# Altium schematic sheet SoM-Connectors.SchDoc
size A3; DocumentNumber: 2; SheetNumber: 2; SheetTotal: 9; PageSetup: Record=PageOptions|CenterHorizontal=True|CenterVertical=True|PrintScale=0.97|XCorrection=1.00|YCorrection=1.00|PrintKind=1|BorderSize=5000000|LeftOffset=0|BottomOffset=0|Orientation=2|PaperLength=2970|PaperWidth=2100|Scale=100|PaperSource=7|PrintQuality=600|MediaType=1|DitherType=10|PaperKind=A4|PrintScaleMode=1
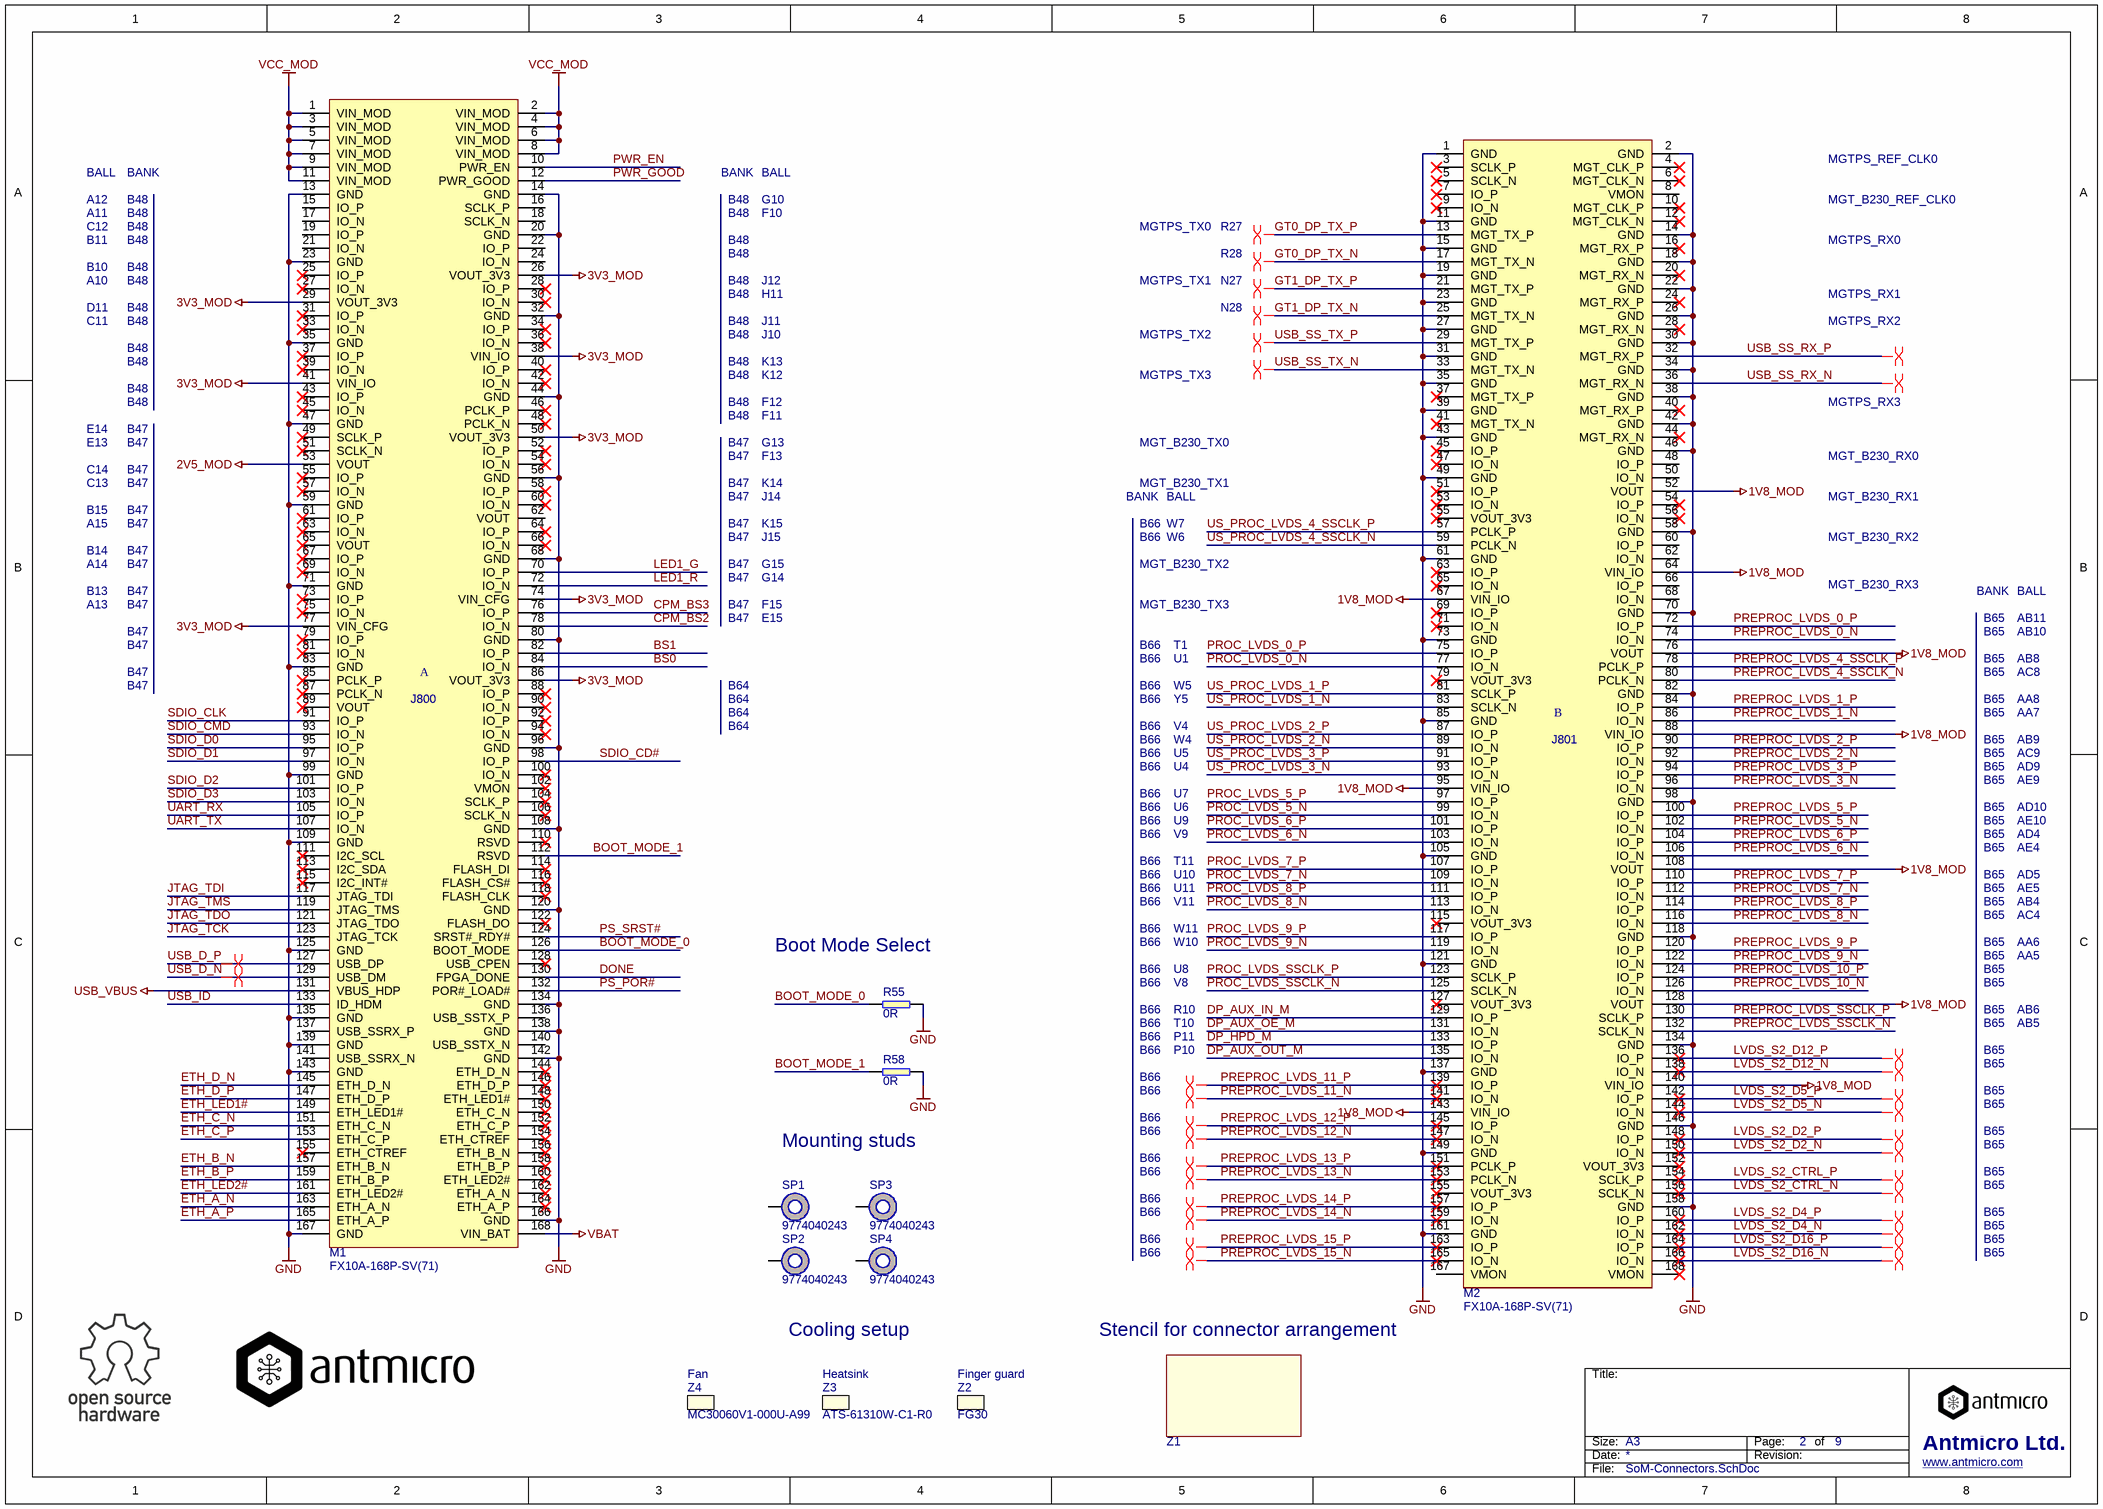
[diagram p0: SoM-Connectors.SchDoc]

## Parts
M1  FX10A-168P-SV(71)  [HIROSE_FX10A-168P-SV(71)]
M2  FX10A-168P-SV(71)  [HIROSE_FX10A-168P-SV(71)]
R55  0R  [0603]
R58  0R  [0603]
SP1  9774040243  [M2-4mm]
SP2  9774040243  [M2-4mm]
SP3  9774040243  [M2-4mm]
SP4  9774040243  [M2-4mm]
Z1  Mechanical  [mercury_74x54_module]  (value not drawn)  (no BOM)
Z2  FG30  (no BOM)
Z3  ATS-61310W-C1-R0  (no BOM)
Z4  MC30060V1-000U-A99  (no BOM)

## Nets
1V8_MOD: M2.52(VOUT) M2.64(VIN_IO) M2.67(VIN_IO) M2.76(VOUT) M2.88(VIN_IO) M2.95(VIN_IO) M2.108(VOUT) M2.128(VOUT) M2.140(VIN_IO) M2.143(VIN_IO)
2V5_MOD: M1.53(VOUT)
3V3_MOD: M1.26(VOUT_3V3) M1.29(VOUT_3V3) M1.38(VIN_IO) M1.41(VIN_IO) M1.50(VOUT_3V3) M1.74(VIN_CFG) M1.77(VIN_CFG) M1.86(VOUT_3V3)
GND: M1.13(GND) M1.14(GND) M1.20(GND) M1.23(GND) M1.32(GND) M1.35(GND) M1.44(GND) M1.47(GND) M1.56(GND) M1.59(GND) M1.68(GND) M1.71(GND) M1.80(GND) M1.83(GND) M1.96(GND) M1.99(GND) M1.108(GND) M1.109(GND) M1.120(GND) M1.125(GND) M1.134(GND) M1.135(GND) M1.138(GND) M1.139(GND) M1.142(GND) M1.143(GND) M1.166(GND) M1.167(GND) M2.1(GND) M2.2(GND) M2.11(GND) M2.14(GND) M2.15(GND) M2.18(GND) M2.19(GND) M2.22(GND) M2.23(GND) M2.26(GND) M2.27(GND) M2.30(GND) M2.31(GND) M2.34(GND) M2.35(GND) M2.38(GND) M2.39(GND) M2.42(GND) M2.43(GND) M2.46(GND) M2.49(GND) M2.58(GND) M2.61(GND) M2.70(GND) M2.73(GND) M2.82(GND) M2.85(GND) M2.98(GND) M2.105(GND) M2.118(GND) M2.121(GND) M2.134(GND) M2.137(GND) M2.146(GND) M2.149(GND) M2.158(GND) M2.161(GND) R55.2 R58.2
USB_VBUS: M1.131(VBUS_HDP)
VBAT: M1.168(VIN_BAT)
VCC_MOD: M1.1(VIN_MOD) M1.2(VIN_MOD) M1.3(VIN_MOD) M1.4(VIN_MOD) M1.5(VIN_MOD) M1.6(VIN_MOD) M1.7(VIN_MOD) M1.8(VIN_MOD) M1.9(VIN_MOD) M1.11(VIN_MOD)
BOOT_MODE_0: M1.126(BOOT_MODE) R55.1
BOOT_MODE_1: M1.112(RSVD) R58.1
BS0: M1.84(IO_N)
BS1: M1.82(IO_P)
CPM_BS2: M1.78(IO_N)
CPM_BS3: M1.76(IO_P)
DONE: M1.130(FPGA_DONE)
DP_AUX_IN_M: M2.129(IO_P)
DP_AUX_OE_M: M2.131(IO_N)
DP_AUX_OUT_M: M2.135(IO_N)
DP_HPD_M: M2.133(IO_P)
ETH_A_N: M1.163(ETH_A_N)
ETH_A_P: M1.165(ETH_A_P)
ETH_B_N: M1.157(ETH_B_N)
ETH_B_P: M1.159(ETH_B_P)
ETH_C_N: M1.151(ETH_C_N)
ETH_C_P: M1.153(ETH_C_P)
ETH_D_N: M1.145(ETH_D_N)
ETH_D_P: M1.147(ETH_D_P)
ETH_LED1#: M1.149(ETH_LED1#)
ETH_LED2#: M1.161(ETH_LED2#)
GT0_DP_TX_N: M2.17(MGT_TX_N)
GT0_DP_TX_P: M2.13(MGT_TX_P)
GT1_DP_TX_N: M2.25(MGT_TX_N)
GT1_DP_TX_P: M2.21(MGT_TX_P)
JTAG_TCK: M1.123(JTAG_TCK)
JTAG_TDI: M1.117(JTAG_TDI)
JTAG_TDO: M1.121(JTAG_TDO)
JTAG_TMS: M1.119(JTAG_TMS)
LED1_G: M1.70(IO_P)
LED1_R: M1.72(IO_N)
LVDS_S2_CTRL_N: M2.156(SCLK_N)
LVDS_S2_CTRL_P: M2.154(SCLK_P)
LVDS_S2_D2_N: M2.150(IO_N)
LVDS_S2_D2_P: M2.148(IO_P)
LVDS_S2_D4_N: M2.162(IO_N)
LVDS_S2_D4_P: M2.160(IO_P)
LVDS_S2_D5_N: M2.144(IO_N)
LVDS_S2_D5_P: M2.142(IO_P)
LVDS_S2_D12_N: M2.138(IO_N)
LVDS_S2_D12_P: M2.136(IO_P)
LVDS_S2_D16_N: M2.166(IO_N)
LVDS_S2_D16_P: M2.164(IO_P)
PREPROC_LVDS_0_N: M2.74(IO_N)
PREPROC_LVDS_0_P: M2.72(IO_P)
PREPROC_LVDS_1_N: M2.86(IO_N)
PREPROC_LVDS_1_P: M2.84(IO_P)
PREPROC_LVDS_2_N: M2.92(IO_N)
PREPROC_LVDS_2_P: M2.90(IO_P)
PREPROC_LVDS_3_N: M2.96(IO_N)
PREPROC_LVDS_3_P: M2.94(IO_P)
PREPROC_LVDS_4_SSCLK_N: M2.80(PCLK_N)
PREPROC_LVDS_4_SSCLK_P: M2.78(PCLK_P)
PREPROC_LVDS_5_N: M2.102(IO_N)
PREPROC_LVDS_5_P: M2.100(IO_P)
PREPROC_LVDS_6_N: M2.106(IO_N)
PREPROC_LVDS_6_P: M2.104(IO_P)
PREPROC_LVDS_7_N: M2.112(IO_N)
PREPROC_LVDS_7_P: M2.110(IO_P)
PREPROC_LVDS_8_N: M2.116(IO_N)
PREPROC_LVDS_8_P: M2.114(IO_P)
PREPROC_LVDS_9_N: M2.122(IO_N)
PREPROC_LVDS_9_P: M2.120(IO_P)
PREPROC_LVDS_10_N: M2.126(IO_N)
PREPROC_LVDS_10_P: M2.124(IO_P)
PREPROC_LVDS_11_N: M2.141(IO_N)
PREPROC_LVDS_11_P: M2.139(IO_P)
PREPROC_LVDS_12_N: M2.147(IO_N)
PREPROC_LVDS_12_P: M2.145(IO_P)
PREPROC_LVDS_13_N: M2.153(PCLK_N)
PREPROC_LVDS_13_P: M2.151(PCLK_P)
PREPROC_LVDS_14_N: M2.159(IO_N)
PREPROC_LVDS_14_P: M2.157(IO_P)
PREPROC_LVDS_15_N: M2.165(IO_N)
PREPROC_LVDS_15_P: M2.163(IO_P)
PREPROC_LVDS_SSCLK_N: M2.132(SCLK_N)
PREPROC_LVDS_SSCLK_P: M2.130(SCLK_P)
PROC_LVDS_0_N: M2.77(IO_N)
PROC_LVDS_0_P: M2.75(IO_P)
PROC_LVDS_5_N: M2.99(IO_N)
PROC_LVDS_5_P: M2.97(IO_P)
PROC_LVDS_6_N: M2.103(IO_N)
PROC_LVDS_6_P: M2.101(IO_P)
PROC_LVDS_7_N: M2.109(IO_N)
PROC_LVDS_7_P: M2.107(IO_P)
PROC_LVDS_8_N: M2.113(IO_N)
PROC_LVDS_8_P: M2.111(IO_P)
PROC_LVDS_9_N: M2.119(IO_N)
PROC_LVDS_9_P: M2.117(IO_P)
PROC_LVDS_SSCLK_N: M2.125(SCLK_N)
PROC_LVDS_SSCLK_P: M2.123(SCLK_P)
PS_POR#: M1.132(POR#_LOAD#)
PS_SRST#: M1.124(SRST#_RDY#)
PWR_EN: M1.10(PWR_EN)
PWR_GOOD: M1.12(PWR_GOOD)
SDIO_CD#: M1.98(IO_P)
SDIO_CLK: M1.91(IO_P)
SDIO_CMD: M1.93(IO_N)
SDIO_D0: M1.95(IO_P)
SDIO_D1: M1.97(IO_N)
SDIO_D2: M1.101(IO_P)
SDIO_D3: M1.103(IO_N)
UART_RX: M1.105(IO_P)
UART_TX: M1.107(IO_N)
US_PROC_LVDS_1_N: M2.83(SCLK_N)
US_PROC_LVDS_1_P: M2.81(SCLK_P)
US_PROC_LVDS_2_N: M2.89(IO_N)
US_PROC_LVDS_2_P: M2.87(IO_P)
US_PROC_LVDS_3_N: M2.93(IO_N)
US_PROC_LVDS_3_P: M2.91(IO_P)
US_PROC_LVDS_4_SSCLK_N: M2.59(PCLK_N)
US_PROC_LVDS_4_SSCLK_P: M2.57(PCLK_P)
USB_D_N: M1.129(USB_DM)
USB_D_P: M1.127(USB_DP)
USB_ID: M1.133(ID_HDM)
USB_SS_RX_N: M2.36(MGT_RX_N)
USB_SS_RX_P: M2.32(MGT_RX_P)
USB_SS_TX_N: M2.33(MGT_TX_N)
USB_SS_TX_P: M2.29(MGT_TX_P)

Not connected (* = marked no-connect by the designer): M1 15(IO_P) 16(SCLK_P) 17(IO_N) 18(SCLK_N) 19(IO_P) 21(IO_N) 22(IO_P) 24(IO_N) 25(IO_P)* 27(IO_N)* 28(IO_P)* 30(IO_N)* 31(IO_P)* 33(IO_N)* 34(IO_P)* 36(IO_N)* 37(IO_P)* 39(IO_N)* 40(IO_P)* 42(IO_N)* 43(IO_P)* 45(IO_N)* 46(PCLK_P)* 48(PCLK_N)* 49(SCLK_P)* 51(SCLK_N)* 52(IO_P)* 54(IO_N)* 55(IO_P)* 57(IO_N)* 58(IO_P)* 60(IO_N)* 61(IO_P)* 62(VOUT) 63(IO_N)* 64(IO_P)* 65(VOUT)* 66(IO_N)* 67(IO_P)* 69(IO_N)* 73(IO_P)* 75(IO_N)* 79(IO_P)* 81(IO_N)* 85(PCLK_P)* 87(PCLK_N)* 88(IO_P)* 89(VOUT)* 90(IO_N)* 92(IO_P)* 94(IO_N)* 100(IO_N)* 102(VMON)* 104(SCLK_P)* 106(SCLK_N)* 110(RSVD)* 111(I2C_SCL)* 113(I2C_SDA)* 114(FLASH_DI)* 115(I2C_INT#)* 116(FLASH_CS#)* 118(FLASH_CLK)* 122(FLASH_DO)* 128(USB_CPEN)* 136(USB_SSTX_P) 137(USB_SSRX_P) 140(USB_SSTX_N) 141(USB_SSRX_N) 144(ETH_D_N)* 146(ETH_D_P)* 148(ETH_LED1#)* 150(ETH_C_N)* 152(ETH_C_P)* 154(ETH_CTREF)* 155(ETH_CTREF)* 156(ETH_B_N)* 158(ETH_B_P)* 160(ETH_LED2#)* 162(ETH_A_N)* 164(ETH_A_P)*; M2 3(SCLK_P)* 4(MGT_CLK_P)* 5(SCLK_N)* 6(MGT_CLK_N)* 7(IO_P)* 8(VMON) 9(IO_N)* 10(MGT_CLK_P)* 12(MGT_CLK_N)* 16(MGT_RX_P)* 20(MGT_RX_N)* 24(MGT_RX_P)* 28(MGT_RX_N)* 37(MGT_TX_P)* 40(MGT_RX_P)* 41(MGT_TX_N)* 44(MGT_RX_N)* 45(IO_P)* 47(IO_N)* 48(IO_P) 50(IO_N) 51(IO_P)* 53(IO_N)* 54(IO_P)* 55(VOUT_3V3)* 56(IO_N)* 60(IO_P) 62(IO_N) 63(IO_P)* 65(IO_N)* 66(IO_P) 68(IO_N) 69(IO_P)* 71(IO_N)* 79(VOUT_3V3)* 115(VOUT_3V3)* 127(VOUT_3V3)* 152(VOUT_3V3)* 155(VOUT_3V3)* 167(VMON) 168(VMON)*; SP1 1; SP2 1; SP3 1; SP4 1

## Layout directives
differential pair: GT0_DP_TX_N, GT0_DP_TX_P, GT1_DP_TX_N, GT1_DP_TX_P, LVDS_S2_CTRL_N, LVDS_S2_CTRL_P, LVDS_S2_D2_N, LVDS_S2_D2_P, LVDS_S2_D4_N, LVDS_S2_D4_P, LVDS_S2_D5_N, LVDS_S2_D5_P, LVDS_S2_D12_N, LVDS_S2_D12_P, LVDS_S2_D16_N, LVDS_S2_D16_P, PREPROC_LVDS_11_N, PREPROC_LVDS_11_P, PREPROC_LVDS_12_N, PREPROC_LVDS_12_P, PREPROC_LVDS_13_N, PREPROC_LVDS_13_P, PREPROC_LVDS_14_N, PREPROC_LVDS_14_P, PREPROC_LVDS_15_N, PREPROC_LVDS_15_P, USB_D_N, USB_D_P, USB_SS_RX_N, USB_SS_RX_P, USB_SS_TX_N, USB_SS_TX_P

## Notes on the sheet
- BALL
- BANK
- MGTPS_REF_CLK0
- A12
- A11
- C12
- B11
- B48
- G10
- F10
- MGTPS_TX0
- R27
- MGT_B230_REF_CLK0
- MGTPS_RX0
- B10
- A10
- D11
- J12
- H11
- MGTPS_TX1
- R28
- N27
- N28
- MGTPS_RX1
- C11
- J11
- J10
- K13
- K12
- MGTPS_TX2
- MGTPS_TX3
- MGTPS_RX2
- E14
- E13
- B47
- F12
- F11
- G13
- MGT_B230_TX0
- MGTPS_RX3
- C14
- C13
- B15
- F13
- K14
- J14
- MGT_B230_TX1
- MGT_B230_RX0
- MGT_B230_RX1
- A15
- B14
- A14
- K15
- J15
- G15
- G14
- B66
- MGT_B230_TX2
- W7
- W6
- MGT_B230_RX2
- MGT_B230_RX3
- B13
- A13
- F15
- E15
- MGT_B230_TX3
- T1
- B65
- AB11
- AB10
- (near M1) J800
- B64
- U1
- W5
- Y5
- AB8
- AC8
- AA8
- AA7
- V4
- W4
- U5
- U4
- (near M2) J801
- AB9
- AC9
- AD9
- AE9
- U7
- U6
- U9
- V9
- AD10
- AE10
- AD4
- AE4
- T11
- U10
- U11
- V11
- AD5
- AE5
- AB4
- AC4
- (near R55) Boot Mode Select
- W11
- W10
- U8
- V8
- AA6
- AA5
- R10
- T10
- P11
- P10
- AB6
- AB5
- Mounting studs
- (near Z4) Fan
- Cooling setup
- (near Z3) Heatsink
- (near Z2) Finger guard
- Stencil for connector arrangement
- Title:
- Size:
- Date:
- A3
- Revision:
- Page:
- of
- Antmicro Ltd.
- File:
- www.antmicro.com
- (in symbol Mercury_US1_A) A
- (in symbol Mercury_US1_B) B

## Library data of the parts
M1 = Mercury_US1_A: Enclustra Mercury Ultrascale connector; Manufacturer: Hirose; Part Number: Mercury_US1_A; Value: FX10A-168P-SV(71); MPN: FX10A-168P-SV(71)
M2 = Mercury_US1_B: Enclustra Mercury Ultrascale connector; Manufacturer: Hirose; Part Number: Mercury_US1_B; Value: FX10A-168P-SV(71); MPN: FX10A-168P-SV(71)
R55 R58 = R_0R_0603: SMT Resistor 0R 0603; Manufacturer: BOURNS; MPN: CR0603-J/-000ELF; Value: 0R; Part Number: R_0R_0603
SP1-SP4 = WE_9774040243: M2x4; Manufacturer: WURTH ELEKTRONIK; MPN: 9774040243R; Part Number: WE_9774040243; Value: 9774040243
Z1 = MercuryModule_74x54: Part Number: MercuryModule_74x54
Z2 = FG30: Fan Finger Guard, Grille, 30mm 30mm 24mm, steel; Manufacturer: SEPA; Part Number: FG30; Value: FG30; MPN: FG30
Z3 = ATS-61310W-C1-R0: Heat Sinks FANSINK ASSY 30.25 X 30.25 X 24.5 (MM); Manufacturer: Advanced Thermal Solution; Part Number: ATS-61310W-C1-R0; Value: ATS-61310W-C1-R0; MPN: ATS-61310W-C1-R0
Z4 = MC30060V1-000U-A99: Fan: DC; axial; 5VDC; 30x30x6mm; 8.32m3/h; 28dBA; Vapo; 3.55mmH2O; Manufacturer: SUNON; Part Number: MC30060V1-000U-A99; Value: MC30060V1-000U-A99; MPN: MC30060V1-000U-A99